# EAGLE schematic MotorDriver (EAGLE 7.7.0)
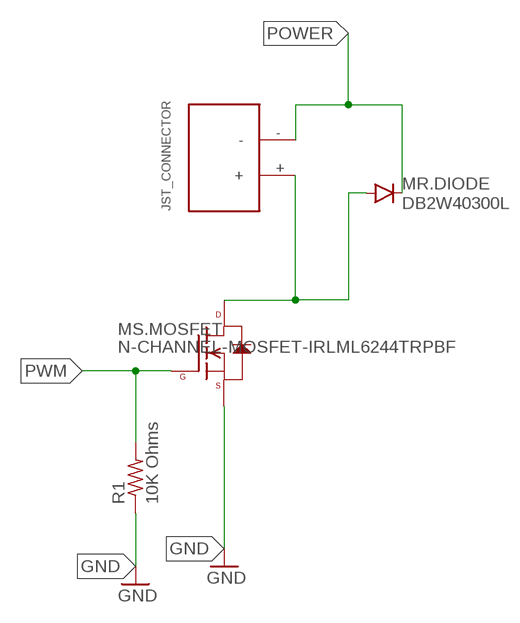
[diagram p0: schematic, sheet 1]

## Parts
MOTOR  JST_CONNECTOR_FEMALE  [JST_CONNECTOR_FEMALE]
MR.DIODE  DB2W40300L  [MINI2-F3-B]
MS.MOSFET  N-CHANNEL-MOSFET-IRLML6244TRPBF  [SOT23-3]
R1  10K Ohms  R-US_0204/5  [0204/5]

## Nets
DRAIN: MOTOR.+ MR.DIODE.POS(PPIN) MS.MOSFET.3(D)
GND: MS.MOSFET.2(S) R1.1
POWER: MOTOR.- MR.DIODE.NEG(GPIN)
PWM: MS.MOSFET.1(G) R1.2

## Library data of the parts
MOTOR = quad:JST_CONNECTOR_FEMALE
MR.DIODE = quad:DB2W40300L
MS.MOSFET = quad:N-CHANNEL-MOSFET: N-Channel MOSFET Mode Field Effect Transistor; DATASHEET: http://www.mouser.com/ds/2/196/irlml6244pbf-936666.pdf; MOUSER: 942-IRLML6244TRPBF; URL: http://www.mouser.com/Search/ProductDetail.aspx?R=IRLML6244TRPBFvirtualkey57370000virtualkey942-IRLML6244TRPBF
R1 = rcl:R-US_: RESISTOR, American symbol